# Altium schematic sheet 5_Auto_Reset.SchDoc: Auto_Reset
size A4; ApprovedBy: Alcatraz; CheckedBy: Alcatraz; Author: Alcatraz; CompanyName: DHNLAB; DrawnBy: Alcatraz; Engineer: Alcatraz; Organization: DHNLAB PVT LTD; Address1: DHANBAD; Address2: JHARKHAND; Address3: INDIA; Address4: ASIA; DocumentNumber: 5; Revision: 1.0; SheetNumber: 5; SheetTotal: 7; ProjectTitle: USB-UART-ISO-CP2102
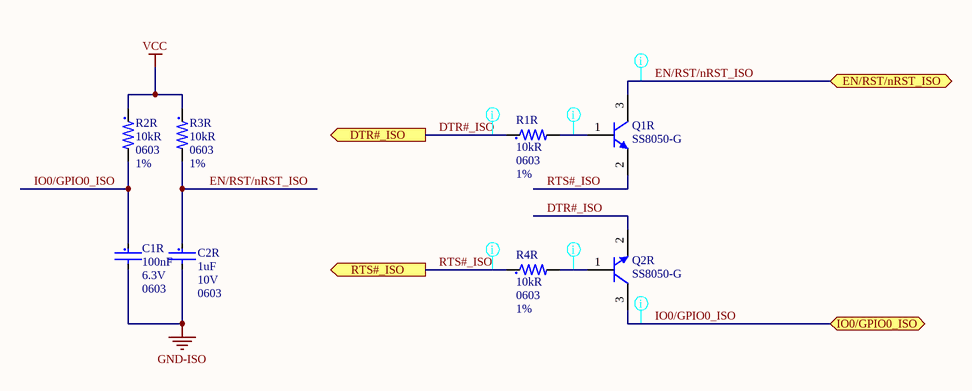
[diagram p0: 5_Auto_Reset.SchDoc]

## Parts
C1R  value 100nF  Voltage: 6.3V  Package: 0603  [C0603-IPC_C_No_Silk]  (hidden comment: KGM15AR70J104KM)
C2R  value 1uF  Voltage Rating: 10V  Case Code (Imperial): 0603  [C0603-IPC_C_No_Silk]  (hidden comment: C0603C105K8PACTU)
Q1R  SS8050-G  [SOT-23-3-MFG]
Q2R  SS8050-G  [SOT-23-3-MFG]
R1R  value 10kR  Case/Package: 0603  Tolerance: 1%  [R0603-MFG]  (hidden comment: RC0603FR-0710KL)
R2R  value 10kR  Case/Package: 0603  Tolerance: 1%  [R0603-MFG]  (hidden comment: RC0603FR-0710KL)
R3R  value 10kR  Case/Package: 0603  Tolerance: 1%  [R0603-MFG]  (hidden comment: RC0603FR-0710KL)
R4R  value 10kR  Case/Package: 0603  Tolerance: 1%  [R0603-MFG]  (hidden comment: RC0603FR-0710KL)

## Ports
DTR#_ISO (out), EN/RST/nRST_ISO (bidir), IO0/GPIO0_ISO (bidir), RTS#_ISO (out)

## Nets
GND-ISO: C1R.2 C2R.2
VCC: R2R.1 R3R.1
DTR#_ISO: Q2R.2(E) R1R.1 ; port DTR#_ISO
EN/RST/nRST_ISO: C2R.1 Q1R.3(C) R3R.2 ; port EN/RST/nRST_ISO
IO0/GPIO0_ISO: C1R.1 Q2R.3(C) R2R.2 ; port IO0/GPIO0_ISO
RTS#_ISO: Q1R.2(E) R4R.1 ; port RTS#_ISO
NetQ1R_1: Q1R.1(B) R1R.2
NetQ2R_1: Q2R.1(B) R4R.2

## Layout directives
net class Signal; net class Digital_Signal_Low_Speed; net class Digital_Signal_RS232_ISO: DTR#_ISO, EN/RST/nRST_ISO, IO0/GPIO0_ISO, NetQ1R_1, NetQ2R_1, RTS#_ISO

## Notes on the sheet
- Title:
- Author:
- Approved:
- Size:
- Date:
- Git Hash:
- A4
- Prj:
- SW Version:
- Variant:
- Edited:
- PUBLIC
- File:

## Library data of the parts
C1R = 100nF_6.3V: Cap Cer 0.1UF 6.3V X7R 0603; Manufacturer: KYOCERA AVX; Tol: 10%; Supplier 1: Digikey; Manufacturer Part Number: KGM15AR70J104KM; Category: Ceramic Capacitors; Stock 1: 117167; Pricing 1: 1=0.1, 10=0.032, 50=0.0186, 100=0.0144, 500=0.01082, 1000=0.0085, 2500=0.00772, 5000=0.00711 (USD); Supplier Part Number 1: 478-KGM15AR70J104KMCT-ND
C2R = 1uF_10V: Ceramic Capacitor, Multilayer, Ceramic, 10V, 10% +Tol, 10% -Tol, X5R, 15% TC, 1uF, 0603; Manufacturer: KEMET; Supplier 1: Mouser; Manufacturer Part Number: C0603C105K8PACTU; RoHS: Yes; Category: Ceramic Capacitors; Stock 1: 221942; Pricing 1: 1=0.1, 10=0.03, 50=0.03, 100=0.018, 1000=0.014, 10000=0.009 (USD); Mounting Technology: Surface Mount; Case/Package: 0603; Pins: 2; Case Code (Metric): 1608; Dielectric Material: Ceramic; Weight: 7.1E-05oz; Min Operating Temperature: -55°C; Max Operating Temperature: 85°C; Tolerance: 10%; Packaging: Tape and Reel; Dielectric: X5R; Termination: SMD/SMT; Package Quantity: 1; Series: C; Construction: Flat; Voltage Rating (DC): 10V; Voltage: 10V; Length: 1.6mm; Width: 0.031inch; Height: 0.8mm; Depth: 0.8mm; Thickness: 0.035inch; Radiation Hardening: No; RoHS Compliant: Yes; Reach SVHC Compliant: No; Lead Free: 5697LeadFree
Q1R Q2R = SS8050-G: Trans Gp Bjt NPN 25V 1.5A 300MW 3-PIN SOT-23 T/r; Manufacturer: Comchip; Transition Frequency: 100MHz; Collector-emitter Voltage-Max: 400mV; Collector Base Voltage (VCBO): 40V; Collector Emitter Saturation Voltage: 500mV; Emitter Base Voltage (VEBO): 5V; hFE Min: 200NUMBER; Number of Elements: 1NUMBER; Supplier 1: Verical; Manufacturer Part Number: SS8050-G; RoHS: Yes; Category: Transistors; Stock 1: 2854; Pricing 1: 2854=0.0684 (USD); Mounting Technology: Surface Mount; Case/Package: TO-236-3; Max Operating Temperature: 150°C; Packaging: Cut Tape; Max Collector Current: 1.5A; Max Power Dissipation: 300mW; Collector Emitter Breakdown Voltage: 25V; Max Breakdown Voltage: 25V; Series: -; Power Dissipation: 300mW; Height: 1.15mm; RoHS Compliant: Yes; ComponentLink1URL: http://www.comchiptech.com/admin/files/product/SS8050-G RevA181526.pdf?src-supplier=Digikey; ComponentLink1Description: http://www.comchiptech.com/admin/files/product/SS8050-G RevA181526.pdf?src-supplier=Digikey; Supplier Part Number 1: SS8050-G
R1R R2R R3R R4R = 10K: SMD Chip Resistor, 10 kOhm, ± 1%, 100 mW, 0603 [1608 Metric], Thick Film, General Purpose; Manufacturer: Yageo; Power Rating: 100mW; Voltage Rating: 75V; Temperature Coefficient: 100ppm/°C; Voltage Rating (DC): 50V; Supplier 1: Future Electronics; Manufacturer Part Number: RC0603FR-0710KL; RoHS: Yes; Category: Chip SMD Resistors; Stock 1: 44660000; Pricing 1: 5000=0.0015, 50000=0.0014, 150000=0.0014, 375000=0.0013, 1000000=0.0012 (USD); Case Code (Metric): 1608; Case Code (Imperial): 0603; Min Operating Temperature: -55°C; Max Operating Temperature: 155°C; Packaging: Tape and Reel; Termination: SMD/SMT; Series: RC; Length: 1.6mm; Width: 0.8mm; Height: 0.45mm; Depth: 0.8mm; RoHS Compliant: Yes; Lead Free: 5697LeadFree; Supplier Part Number 1: 4023214; Construction: Rectangular; Military Standard: Not; Pins: 2; Weight: 7.1E-05oz; Resistance Tolerance: 1%; Resistor Type: Thick Film; Max Power Dissipation: 100mW; Features: Moisture Resistant; Number of Terminations: 2; Lead Pitch: 0.3mm; Reach SVHC Compliant: No